# Altium schematic sheet Interfaces.SchDoc
size A; SheetNumber: 4; SheetTotal: 6
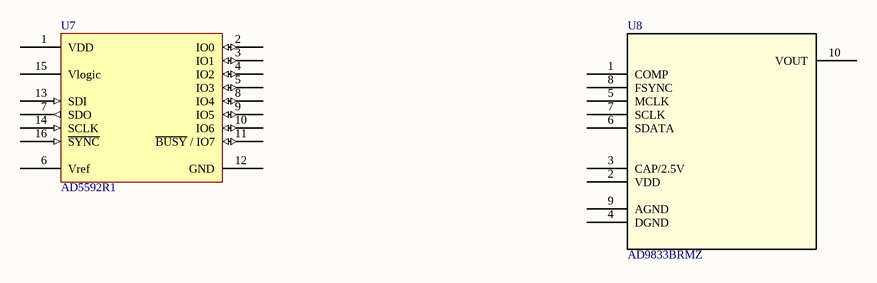
[diagram p0: Interfaces.SchDoc]

## Parts
U7  AD5592R1  [LFCSP CP 16 2]
U8  AD9833BRMZ  [RM_10_ADI]

## Nets

Not connected (* = marked no-connect by the designer): U7 1(VDD) 2(IO0) 3(IO1) 4(IO2) 5(IO3) 6(Vref) 7(SDO) 8(IO4) 9(IO5) 10(IO6) 11(~{BUSY}_/_IO7) 12(GND) 13(SDI) 14(SCLK) 15(Vlogic) 16(~{SYNC}); U8 1(COMP) 2(VDD) 3(CAP/2.5V) 4(DGND) 5(MCLK) 6(SDATA) 7(SCLK) 8(FSYNC) 9(AGND) 10(VOUT)

## Library data of the parts
U7 = AD5592R1: 8-Channel, 12-Bit, Configurable ADC/DAC with On-Chip Reference, SPI Interface; pin to pad: 1>3 2>4 3>5 4>6 5>7 6>8 7>9 8>10 9>11 10>12 11>13 12>14 13>15 14>16 16>2; Ref: AD5592R1
U8 = AD9833BRMZ: Low Power, 12.65 mW, 2.3 V to 5.5 V, Programmable Waveform Generator; Vendor: Analog Devices Inc; SourceLibrary: Analog_2015-12-15; Built_By: EMA_UL_Team; Manufacturer_Part_Number: AD9833BRMZ; Copyright: Copyright (C) 2018 Accelerated Designs. All rights reserved; RefDes: RefDes; Type: DEV